# EAGLE design 512_outin_raspberry_pi (EAGLE 9.2.2)
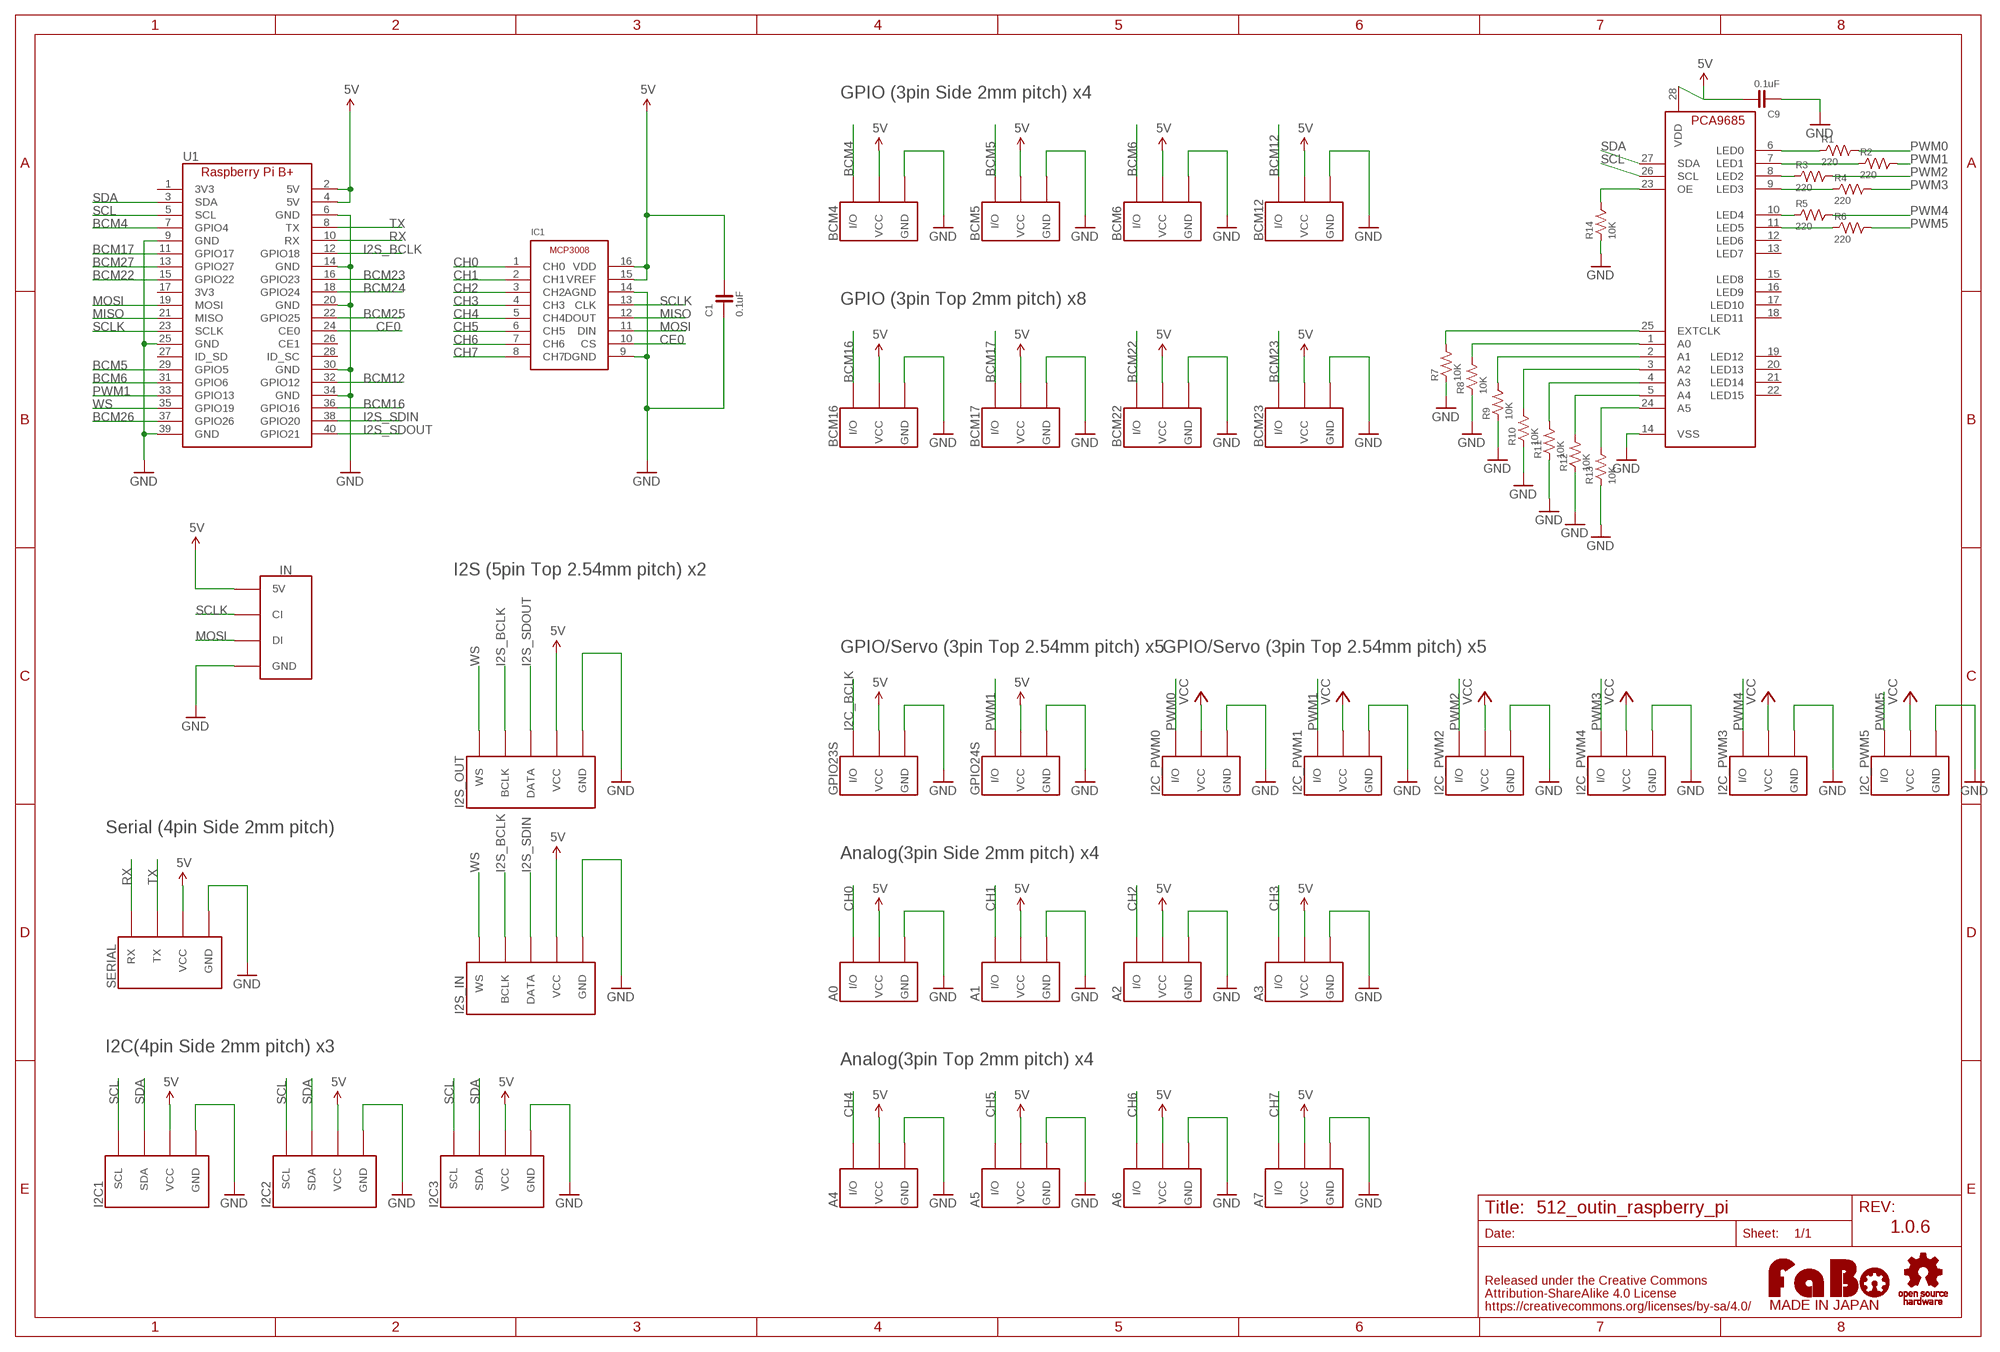
[diagram p0: schematic, sheet 1]

## Parts
A0  FABO_BRICK_3PIN-S03B-PASK-2  [FABO_BRICK_3PIN_S03B-PASK-2]
A1  FABO_BRICK_3PIN-S03B-PASK-2  [FABO_BRICK_3PIN_S03B-PASK-2]
A2  FABO_BRICK_3PIN-S03B-PASK-2  [FABO_BRICK_3PIN_S03B-PASK-2]
A3  FABO_BRICK_3PIN-S03B-PASK-2  [FABO_BRICK_3PIN_S03B-PASK-2]
A4  FABO_BRICK_3PIN-B03B-PASK-1  [FABO_BRICK_3PIN_B03B-PASK-1]
A5  FABO_BRICK_3PIN-B03B-PASK-1  [FABO_BRICK_3PIN_B03B-PASK-1]
A6  FABO_BRICK_3PIN-B03B-PASK-1  [FABO_BRICK_3PIN_B03B-PASK-1]
A7  FABO_BRICK_3PIN-B03B-PASK-1  [FABO_BRICK_3PIN_B03B-PASK-1]
BCM4  FABO_BRICK_3PIN-S03B-PASK-2  [FABO_BRICK_3PIN_S03B-PASK-2]
BCM5  FABO_BRICK_3PIN-S03B-PASK-2  [FABO_BRICK_3PIN_S03B-PASK-2]
BCM6  FABO_BRICK_3PIN-S03B-PASK-2  [FABO_BRICK_3PIN_S03B-PASK-2]
BCM12  FABO_BRICK_3PIN-S03B-PASK-2  [FABO_BRICK_3PIN_S03B-PASK-2]
BCM16  FABO_BRICK_3PIN-B03B-PASK-1  [FABO_BRICK_3PIN_B03B-PASK-1]
BCM17  FABO_BRICK_3PIN-B03B-PASK-1  [FABO_BRICK_3PIN_B03B-PASK-1]
BCM22  FABO_BRICK_3PIN-B03B-PASK-1  [FABO_BRICK_3PIN_B03B-PASK-1]
BCM23  FABO_BRICK_3PIN-B03B-PASK-1  [FABO_BRICK_3PIN_B03B-PASK-1]
C1  0.1uF  CAPACITOR-0603  [0603]
C9  0.1uF  CAPACITOR-0603  [0603]
GPIO23S  FABO_BRICK_3PIN-HEADER  [FABO_BRICK_3PIN_HEADER]
GPIO24S  FABO_BRICK_3PIN-HEADER  [FABO_BRICK_3PIN_HEADER]
I2C1  FABO_BRICK_I2C-S04B-PASK-2  [FABO_BRICK_I2C_S04B-PASK-2]
I2C2  FABO_BRICK_I2C-S04B-PASK-2  [FABO_BRICK_I2C_S04B-PASK-2]
I2C3  FABO_BRICK_I2C-S04B-PASK-2  [FABO_BRICK_I2C_S04B-PASK-2]
I2C_PWM0  FABO_BRICK_3PIN-HEADER  [FABO_BRICK_3PIN_HEADER]
I2C_PWM1  FABO_BRICK_3PIN-HEADER  [FABO_BRICK_3PIN_HEADER]
I2C_PWM2  FABO_BRICK_3PIN-HEADER  [FABO_BRICK_3PIN_HEADER]
I2C_PWM3  FABO_BRICK_3PIN-HEADER  [FABO_BRICK_3PIN_HEADER]
I2C_PWM4  FABO_BRICK_3PIN-HEADER  [FABO_BRICK_3PIN_HEADER]
I2C_PWM5  FABO_BRICK_3PIN-HEADER  [FABO_BRICK_3PIN_HEADER]
I2S_IN  FABO_BRICK_I2STOP  [FABO_BRICK_I2S_B05B-PARK-1]
I2S_OUT  FABO_BRICK_I2STOP  [FABO_BRICK_I2S_B05B-PARK-1]
IC1  MICROCHIP-MCP3008  [MICROCHIP-MCP3008]
LED  FABO_BRICK_SPI_LED  [FABO_BRICK_SPI_LED]
R1  220  RESISTOR-0603  [0603]
R2  220  RESISTOR-0603  [0603]
R3  220  RESISTOR-0603  [0603]
R4  220  RESISTOR-0603  [0603]
R5  220  RESISTOR-0603  [0603]
R6  220  RESISTOR-0603  [0603]
R7  10K  RESISTOR-0603  [0603]
R8  10K  RESISTOR-0603  [0603]
R9  10K  RESISTOR-0603  [0603]
R10  10K  RESISTOR-0603  [0603]
R11  10K  RESISTOR-0603  [0603]
R12  10K  RESISTOR-0603  [0603]
R13  10K  RESISTOR-0603  [0603]
R14  10K  RESISTOR-0603  [0603]
SERIAL  FABO_BRICK_SERIAL-S04B-PASK-2  [FABO_BRICK_SERIAL_S04B-PASK-2]
U1  RASPBERRY_PI_B+NORMAL  [RASPBERRY_PI_B+]
U$4  LOGO_OSHW-T_M_BOTTOM  [LOGO_OSHW_T_MS_BOTTOM]
U$9  PCA9685  [PCA9685]
U$14  LOGO_FABO-M  [LOGO_FABO_MS]

## Nets
5V: A0.VCC A1.VCC A2.VCC A3.VCC A4.VCC A5.VCC A6.VCC A7.VCC BCM4.VCC BCM5.VCC BCM6.VCC BCM12.VCC BCM16.VCC BCM17.VCC BCM22.VCC BCM23.VCC C1.2 C9.2 GPIO23S.VCC GPIO24S.VCC I2C1.VCC I2C2.VCC I2C3.VCC I2S_IN.VCC I2S_OUT.VCC IC1.15(VREF) IC1.16(VDD) LED.5V SERIAL.VCC U1.2(5V) U1.4(5V) U$9.28(VDD)
BCM4: BCM4.I/O U1.7(GPIO4)
BCM5: BCM5.I/O U1.29(GPIO5)
BCM6: BCM6.I/O U1.31(GPIO6)
BCM12: BCM12.I/O U1.32(GPIO12)
BCM16: BCM16.I/O U1.36(GPIO16)
BCM17: BCM17.I/O U1.11(GPIO17)
BCM22: BCM22.I/O U1.15(GPIO22)
BCM23: BCM23.I/O U1.16(GPIO23)
BCM24: U1.18(GPIO24)
BCM25: U1.22(GPIO25)
BCM26: U1.37(GPIO26)
BCM27: U1.13(GPIO27)
CE0: IC1.10(CS) U1.24(CE0)
CH0: A0.I/O IC1.1(CH0)
CH1: A1.I/O IC1.2(CH1)
CH2: A2.I/O IC1.3(CH2)
CH3: A3.I/O IC1.4(CH3)
CH4: A4.I/O IC1.5(CH4)
CH5: A5.I/O IC1.6(CH5)
CH6: A6.I/O IC1.7(CH6)
CH7: A7.I/O IC1.8(CH7)
GND: A0.GND A1.GND A2.GND A3.GND A4.GND A5.GND A6.GND A7.GND BCM4.GND BCM5.GND BCM6.GND BCM12.GND BCM16.GND BCM17.GND BCM22.GND BCM23.GND C1.1 C9.1 GPIO23S.GND GPIO24S.GND I2C1.GND I2C2.GND I2C3.GND I2C_PWM0.GND I2C_PWM1.GND I2C_PWM2.GND I2C_PWM3.GND I2C_PWM4.GND I2C_PWM5.GND I2S_IN.GND I2S_OUT.GND IC1.9(DGND) IC1.14(AGND) LED.GND R7.1 R8.1 R9.1 R10.1 R11.1 R12.1 R13.1 R14.1 SERIAL.GND U1.6(GND) U1.9(GND) U1.14(GND) U1.20(GND) U1.25(GND) U1.30(GND) U1.34(GND) U1.39(GND) U$9.14(VSS)
I2C_BCLK: GPIO23S.I/O
I2S_BCLK: I2S_IN.BCLK I2S_OUT.BCLK U1.12(GPIO18)
I2S_SDIN: I2S_IN.DATA U1.38(GPIO20)
I2S_SDOUT: I2S_OUT.DATA U1.40(GPIO21)
LED0: R1.1 U$9.6(LED0)
LED1: R2.1 U$9.7(LED1)
LED2: R3.1 U$9.8(LED2)
LED3: R4.1 U$9.9(LED3)
LED4: R5.1 U$9.10(LED4)
LED5: R6.1 U$9.11(LED5)
MISO: IC1.12(DOUT) U1.21(MISO)
MOSI: IC1.11(DIN) LED.DI U1.19(MOSI)
N$7: R14.2 U$9.23(OE)
N$8: R7.2 U$9.25(EXTCLK)
N$9: R8.2 U$9.1(A0)
N$10: R9.2 U$9.2(A1)
N$11: R10.2 U$9.3(A2)
N$12: R11.2 U$9.4(A3)
N$13: R12.2 U$9.5(A4)
N$14: R13.2 U$9.24(A5)
PWM0: I2C_PWM0.I/O R1.2
PWM1: GPIO24S.I/O I2C_PWM1.I/O R2.2 U1.33(GPIO13)
PWM2: I2C_PWM2.I/O R3.2
PWM3: I2C_PWM4.I/O R4.2
PWM4: I2C_PWM3.I/O R5.2
PWM5: I2C_PWM5.I/O R6.2
RX: SERIAL.RX U1.10(RX)
SCL: I2C1.SCL I2C2.SCL I2C3.SCL U1.5(SCL) U$9.26(SCL)
SCLK: IC1.13(CLK) LED.CI U1.23(SCLK)
SDA: I2C1.SDA I2C2.SDA I2C3.SDA U1.3(SDA) U$9.27(SDA)
TX: SERIAL.TX U1.8(TX)
VCC: I2C_PWM0.VCC I2C_PWM1.VCC I2C_PWM2.VCC I2C_PWM3.VCC I2C_PWM4.VCC I2C_PWM5.VCC
WS: I2S_IN.WS I2S_OUT.WS U1.35(GPIO19)
Unconnected: U1.1(3V3) U1.17(3V3) U1.26(CE1) U1.27(ID_SD) U1.28(ID_SC) U$9.12(LED6) U$9.13(LED7) U$9.15(LED8) U$9.16(LED9) U$9.17(LED10) U$9.18(LED11) U$9.19(LED12) U$9.20(LED13) U$9.21(LED14) U$9.22(LED15)

## Notes on the sheet
- GPIO (3pin Side 2mm pitch) x4
- GPIO (3pin Top 2mm pitch) x8
- I2S (5pin Top 2.54mm pitch) x2
- GPIO/Servo (3pin Top 2.54mm pitch) x5 | GPIO/Servo (3pin Top 2.54mm pitch) x5
- Serial (4pin Side 2mm pitch)
- Analog(3pin Side 2mm pitch) x4
- I2C(4pin Side 2mm pitch) x3
- Analog(3pin Top 2mm pitch) x4
- 1.0.6

## Library data of the parts
A0 A1-A7 BCM4-BCM6 BCM12 BCM16 BCM17 BCM22 BCM23 GPIO23S GPIO24S I2C_PWM0 I2C_PWM1-I2C_PWM5 = FaBo-Template:FABO_BRICK_3PIN: FaBo Brick 3pin
C1 C9 = FaBo-Capacitor:CAPACITOR: CAPACITOR
I2C1-I2C3 = FaBo-Template:FABO_BRICK_I2C: FaBo Brick I2C
I2S_IN I2S_OUT = FaBo-Template:FABO_BRICK_I2S
IC1 = FaBo-ADC:MICROCHIP-MCP3008
LED = FaBo-Template:FABO_BRICK_SPI_LED
R1-R14 = FaBo-Resistors:RESISTOR: RESISTOR
SERIAL = FaBo-Template:FABO_BRICK_SERIAL: FaBo Brick Serial
U1 = FaBo-Boards:RASPBERRY_PI_B+
U$4 = FaBo-etc:LOGO_OSHW
U$9 = FaBo-Motor:PCA9685
U$14 = FaBo-etc:LOGO_FABO

## Board
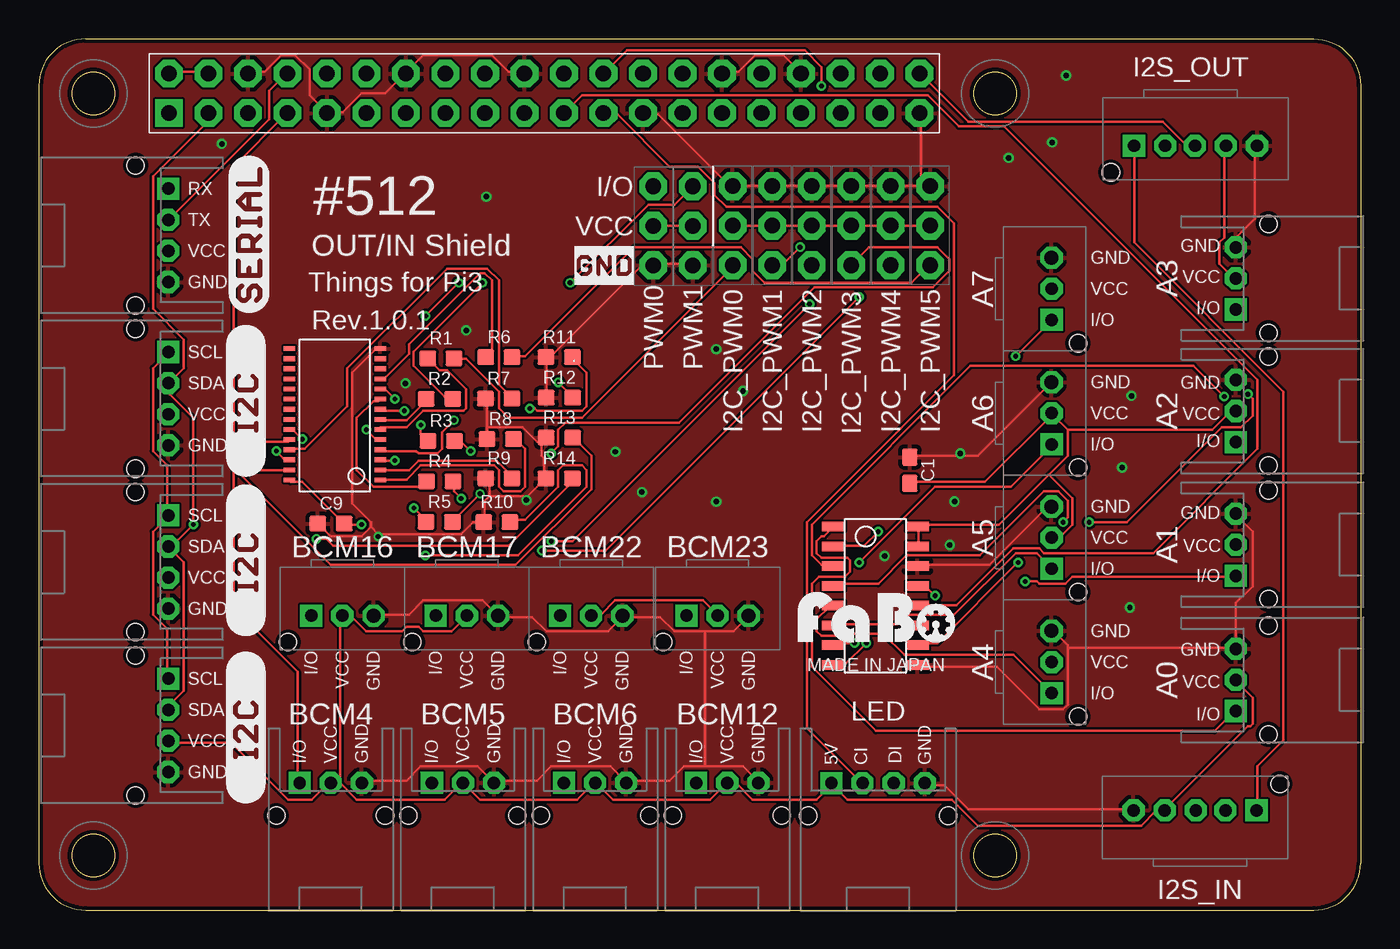
[diagram p1: board, top side]
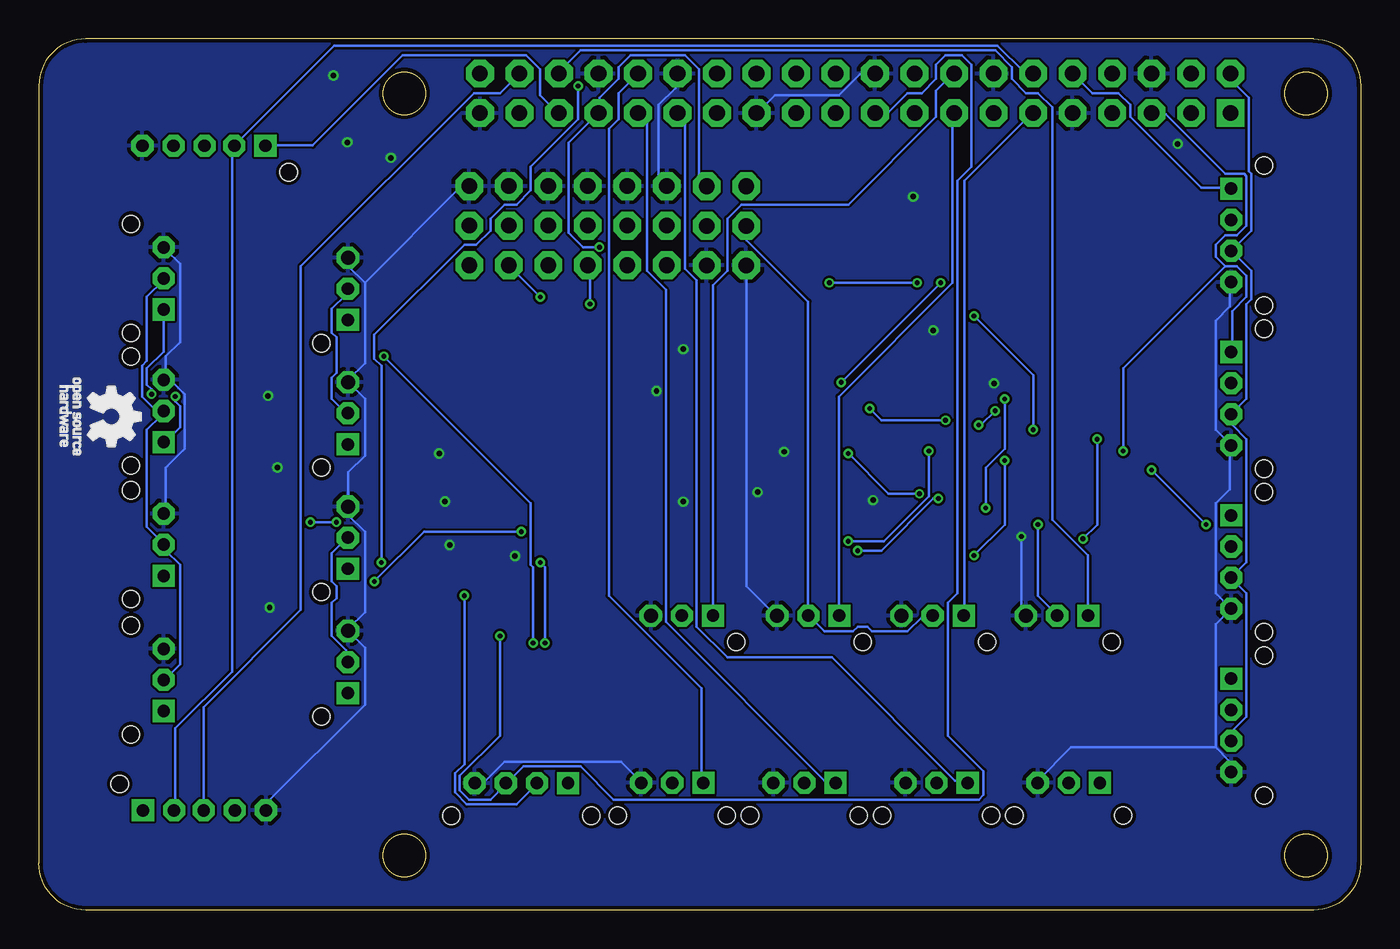
[diagram p2: board, bottom side, seen from below]

Size 85 x 56 mm. Coordinates in mm from the lower left corner, seen from the top.
Copper layers (1*16): Top 0.035mm / dielectric 1.5mm / Bottom 0.035mm
Design rules "Elecrow_2-layer_eagle_rule": minimum track width 6mil, minimum drill 12mil, track to track 6mil, track to pad 6mil, pad to pad 6mil, via to via 6mil, smd to smd 0mil, copper to edge 10mil, drill to drill 10mil, minimum pad ring 10mil, minimum via ring 6mil, stop-mask expansion 2mil, vias tented up to drill 100mil, thermal gap 10mil

### Footprints (pad centres in the part's own frame; a part is rotated, then mirrored left to right if it is on the bottom)
FABO_BRICK_3PIN_S03B-PASK-2 = drill 0.8 pad 1.422 octagon: GND -2,0; VCC 0,0 | drill 0.8 pad 1.422 square: I/O 2,0 | hole 1.1: 3.5,2.1; -3.5,2.1
FABO_BRICK_3PIN_B03B-PASK-1 = drill 0.9 pad 1.422 octagon: GND -2,0 | drill 0.8 pad 1.422 square: I/O 2,0 | drill 0.8 pad 1.422 octagon: VCC 0,0 | hole 1.1: 3.5,1.7
0603 = smd 1.1 x 1: 1 -0.85,0; 2 0.85,0
FABO_BRICK_3PIN_HEADER = drill 1 pad 1.778 octagon: GND -2.54,0; I/O 2.54,0; VCC 0,0
FABO_BRICK_I2C_S04B-PASK-2 = drill 0.8 pad 1.422 octagon: GND -3,0; SDA 1,0; VCC -1,0 | drill 0.8 pad 1.422 square: SCL 3,0 | hole 1.1: 4.5,2.1; -4.5,2.1
FABO_BRICK_I2S_B05B-PARK-1 = drill 0.8 pad 1.422 octagon: BCLK 1.635,2.54; DATA -0.27,2.54; GND -4.27,2.54; VCC -2.27,2.54 | drill 0.8 pad 1.422 square: WS 3.635,2.54 | hole 1.1: 5.135,4.24
MICROCHIP-MCP3008 = smd 0.6 x 1.5: 1 -4.445,-2.7; 2 -3.175,-2.7; 3 -1.905,-2.7; 4 -0.635,-2.7; 5 0.635,-2.7; 6 1.905,-2.7; 7 3.175,-2.7; 8 4.445,-2.7; 9 4.445,2.7; 10 3.175,2.7; 11 1.905,2.7; 12 0.635,2.7; 13 -0.635,2.7; 14 -1.905,2.7; 15 -3.175,2.7; 16 -4.445,2.7
FABO_BRICK_SPI_LED = drill 0.8 pad 1.422 square: 5V 3,-3.19 | drill 0.8 pad 1.422 octagon: CI 1,-3.19; DI -1,-3.19; GND -3,-3.19 | hole 1.1: 4.5,-1.09; -4.5,-1.09
FABO_BRICK_SERIAL_S04B-PASK-2 = drill 0.8 pad 1.422 octagon: GND -3,0; TX 1,0; VCC -1,0 | drill 0.8 pad 1.422 square: RX 3,0 | hole 1.1: 4.5,2.1; -4.5,2.1
RASPBERRY_PI_B+ = drill 1 pad 1.778 square: 1 0,-2.54 | drill 1 pad 1.778 octagon: 2 0,0; 3 2.54,-2.54; 4 2.54,0; 5 5.08,-2.54; 6 5.08,0; 7 7.62,-2.54; 8 7.62,0; 9 10.16,-2.54; 10 10.16,0; 11 12.7,-2.54; 12 12.7,0; 13 15.24,-2.54; 14 15.24,0; 15 17.78,-2.54; 16 17.78,0; 17 20.32,-2.54; 18 20.32,0; 19 22.86,-2.54; 20 22.86,0; 21 25.4,-2.54; 22 25.4,0; 23 27.94,-2.54; 24 27.94,0; 25 30.48,-2.54; 26 30.48,0; 27 33.02,-2.54; 28 33.02,0; 29 35.56,-2.54; 30 35.56,0; 31 38.1,-2.54; 32 38.1,0; 33 40.64,-2.54; 34 40.64,0; 35 43.18,-2.54; 36 43.18,0; 37 45.72,-2.54; 38 45.72,0; 39 48.26,-2.54; 40 48.26,0
PCA9685 = smd 0.3 x 0.75: 1 -4.15,-2.93; 2 -3.5,-2.93; 3 -2.85,-2.93; 4 -2.2,-2.93; 5 -1.55,-2.93; 6 -0.9,-2.93; 7 -0.25,-2.93; 8 0.4,-2.93; 9 1.05,-2.93; 10 1.7,-2.93; 11 2.35,-2.93; 12 3,-2.93; 13 3.65,-2.93; 14 4.3,-2.93; 15 4.3,2.92; 16 3.65,2.92; 17 3,2.92; 18 2.35,2.92; 19 1.7,2.92; 20 1.05,2.92; 21 0.4,2.92; 22 -0.25,2.92; 23 -0.9,2.92; 24 -1.55,2.92; 25 -2.2,2.92; 26 -2.85,2.92; 27 -3.5,2.92; 28 -4.15,2.92

### Placement (x,y rotation side)
A0  76.97,14.79 270 top
A1  76.97,23.49 270 top
A2  76.97,32.08 270 top
A3  76.97,40.6 270 top
A4  65.12,15.94 270 top
A5  65.12,23.94 270 top
A6  65.12,31.94 270 top
A7  65.12,39.94 270 top
BCM4  18.77,8.17 180 top
BCM5  27.27,8.17 180 top
BCM6  35.77,8.17 180 top
BCM12  44.27,8.17 180 top
BCM16  19.52,18.92 180 top
BCM17  27.52,18.92 180 top
BCM22  35.52,18.92 180 top
BCM23  43.65,18.93 180 top
C1  56.01,28.27 270 top
C9  18.79,24.84 0 top
GPIO23S  39.52,43.99 90 top
GPIO24S  42.05,43.99 90 top
I2C1  8.32,32.87 90 top
I2C2  8.32,22.37 90 top
I2C3  8.32,11.87 90 top
I2C_PWM0  44.62,43.99 270 top
I2C_PWM1  47.16,43.99 270 top
I2C_PWM2  49.7,43.99 270 top
I2C_PWM3  52.24,43.99 270 top
I2C_PWM4  54.78,43.99 270 top
I2C_PWM5  57.32,43.99 270 top
I2S_IN  74.67,3.87 0 top
I2S_OUT  74.07,51.67 180 top
IC1  53.8,20.2 270 top
LED  53.97,4.97 180 top
R1  25.85,35.46 0 top
R2  25.76,32.86 0 top
R3  25.87,30.16 0 top
R4  25.78,27.56 0 top
R5  25.75,24.95 0 top
R6  29.58,35.54 0 top
R7  29.57,32.87 0 top
R8  29.67,30.27 0 top
R9  29.58,27.75 0 top
R10  29.45,24.94 0 top
R11  33.46,35.54 0 top
R12  33.47,32.94 0 top
R13  33.47,30.37 0 top
R14  33.46,27.75 0 top
SERIAL  8.32,43.37 90 top
U1  8.37,53.77 0 top
U$2  [LOGO_SILK_I2C]  14.57,17.62 90 top
U$3  [LOGO_SILK_SERIAL2]  14.82,38.37 90 top
U$4  80.37,31.71 90 top
U$5  [LOGO_SILK_I2C]  14.57,6.87 90 top
U$6  [LOGO_SILK_I2C]  14.57,27.87 90 top
U$7  [LOGO_SILK_GND]  34.44,40.18 0 top
U$9  19.03,31.79 90 top
U$14  53.88,16.82 0 top

### Tracks (layer width: path | path; a pad name or v marks a point on that pad's centre or on a via)
5V  (via drill 0.3)
  Top 0.152: IC1.15 56.57,23.41 56.57,24.63 IC1.16 56.57,24.78 61.75,24.78 64.95,27.98 | C1.2 56.11,27.52 60.84,27.52 65.1,31.79 A6.VCC 65.25,31.79 66.17,30.87 | 64.95,27.98 66.17,29.2 66.17,30.87 | 64.95,27.98 66.47,26.45 66.47,24.78 65.71,24.02 65.25,24.02 A5.VCC | I2S_OUT.VCC 76.23,49.01 76.23,43.22 75.92,42.91 75.92,41.54 76.84,40.63 A3.VCC | A0.VCC 76.99,14.72 78.06,13.65 78.06,11.98 77.9,11.82 77.75,11.82 72.42,6.49 I2S_IN.VCC 72.26,6.34 71.81,6.34 70.89,5.42 60.38,5.42 58.7,7.1 52,7.1 51.08,8.01 LED.5V 50.93,8.01 50.01,7.1 45.9,7.1 44.83,8.17 44.38,8.17 BCM12.VCC 44.22,8.17 43.16,7.1 36.91,7.1 35.84,8.17 BCM6.VCC 35.69,8.17 34.62,7.1 28.37,7.1 27.31,8.17 BCM5.VCC 27.15,8.17 26.09,7.1 20.45,7.1 19.38,8.17 | 66.17,30.87 75.46,30.87 76.53,31.94 76.84,31.94 A2.VCC | U1.2 8.41,53.89 10.85,53.89 U1.4 | 19.38,8.17 BCM4.VCC | U$9.28 16.18,27.52 16.94,27.52 19.53,24.93 C9.2 19.69,24.78 v20.75,24.78 | BCM17.VCC 27.46,18.83 26.55,17.92 24.72,17.92 24.41,18.23 23.65,18.23 23.34,17.92 21.06,17.92 20.14,18.83 19.53,18.83 BCM16.VCC 19.38,18.83 19.38,8.17 | GPIO23S.VCC 39.65,43.98 41.94,43.98 GPIO24S.VCC | BCM22.VCC 35.54,18.99 36.15,18.99 37.06,19.9 42.7,19.9 43.61,18.99 BCM23.VCC | 19.38,8.17 BCM4.VCC | I2C3.VCC 8.41,10.76 12.37,10.76 16.03,7.1 17.55,7.1 18.62,8.17 BCM4.VCC
  Bottom 0.152: A4.VCC 65.25,15.94 65.25,16.7 66.17,17.62 66.17,19.75 65.86,20.05 65.86,20.82 66.17,21.12 66.17,22.95 65.25,23.86 A5.VCC | A7.VCC 65.25,39.87 65.25,39.56 66.17,38.65 66.17,37.12 65.86,36.82 65.86,34.53 66.17,34.23 66.17,32.86 65.25,31.94 A6.VCC | A0.VCC 76.84,14.87 75.92,15.79 75.92,22.19 76.84,23.1 76.84,23.41 A1.VCC 76.99,23.56 78.06,24.63 78.06,30.87 77.14,31.79 | 77.14,31.79 76.99,31.94 A2.VCC 77.14,31.79 | 77.14,31.79 78.36,33.01 78.36,34.99 78.06,35.29 78.06,39.41 76.99,40.48 A3.VCC | I2C3.VCC 8.26,10.91 8.26,11.52 7.34,12.43 7.34,20.36 8.26,21.27 I2C2.VCC 8.26,21.43 7.34,22.34 7.34,30.26 8.26,31.18 8.26,31.79 I2C1.VCC 8.26,31.94 7.34,32.86 7.34,38.95 7.04,39.26 7.04,41.09 8.26,42.3 SERIAL.VCC 8.26,42.46 7.04,43.68 7.04,47.33 7.19,47.49 7.19,52.21 8.26,53.28 8.26,53.73 U1.2 | v20.75,24.78 20.75,20.21 19.53,18.99 BCM16.VCC | GPIO23S.VCC 39.5,43.98 39.5,43.07 35.54,39.1 35.54,18.99 BCM22.VCC 35.38,18.83 34.47,17.92 32.64,17.92 32.34,18.23 31.73,18.23 31.42,17.92 29.14,17.92 28.22,18.83 27.61,18.83 BCM17.VCC
BCM4
  Top 0.152: BCM4.I/O 16.64,8.32 16.64,15.33 12.52,19.44 12.52,47.79 15.88,51.14 U1.7
BCM5
  Bottom 0.152: BCM5.I/O 25.33,8.32 26.09,8.32 34.01,16.24 40.72,16.24 42.7,18.23 42.7,40.48 43.46,41.24 43.46,50.69 43.92,51.14 U1.29
BCM6
  Bottom 0.152: BCM6.I/O 33.86,8.32 34.47,8.32 44.68,18.53 44.68,39.87 45.9,41.09 45.9,50.69 46.36,51.14 U1.31
BCM12
  Bottom 0.152: BCM12.I/O 42.39,8.32 42.39,14.26 48.34,20.21 48.34,50.23 47.73,50.84 47.73,52.52 46.51,53.73 U1.32
BCM16
  Bottom 0.152: BCM16.I/O 17.55,18.99 17.55,22.8 19.84,25.08 19.84,51.6 20.75,52.52 21.52,52.52 22.43,53.43 22.43,54.19 23.5,55.26 50.17,55.26 51.54,53.89 U1.36
BCM17
  Bottom 0.152: BCM17.I/O 25.48,18.99 25.48,46.88 21.21,51.14 U1.11
BCM22
  Bottom 0.152: BCM22.I/O 33.55,18.99 33.55,33.01 26.24,40.32 26.24,51.14 U1.15
BCM23
  Bottom 0.152: BCM23.I/O 41.63,18.99 41.63,40.17 40.72,41.09 40.72,44.44 39.8,45.35 32.95,45.35 27.31,50.99 27.31,52.67 26.24,53.73 U1.16
CE0  (via drill 0.3)
  Top 0.152: v62.97,22.34 57.79,17.16 56.57,17.16 IC1.10 | v50.32,52.97 50.32,54.19 49.25,55.26 37.82,55.26 36.45,53.89 U1.24
  Bottom 0.152: v62.97,22.34 62.97,34.99 63.43,35.45 63.43,36.97 57.63,42.76 56.87,42.76 55.96,43.68 55.96,44.44 55.04,45.35 54.28,45.35 53.37,46.27 53.37,47.79 50.32,50.84 v50.32,52.97
CH0
  Top 0.152: IC1.1 51.08,24.63 50.47,24.02 50.32,24.02 50.01,23.71 50.01,22.95 50.32,22.64 52,22.64 52.15,22.49 52.15,21.73 51.84,21.43 50.17,21.43 49.71,20.97 49.71,15.63 53.82,11.52 75.62,11.52 76.84,12.74 A0.I/O
CH1  (via drill 0.3)
  Top 0.152: v53.98,24.32 53.06,23.41 51.23,23.41 IC1.2 | v63.43,21.12 64.19,21.12 64.34,20.97 66.02,20.97 66.47,21.43 76.84,21.43 A1.I/O
  Bottom 0.152: v53.98,24.32 60.23,24.32 v63.43,21.12
CH2  (via drill 0.3)
  Top 0.152: v76.23,33.01 74.25,34.99 59.92,34.99 49.71,24.78 49.71,22.8 50.32,22.19 51.08,22.19 IC1.3
  Bottom 0.152: v76.23,33.01 76.23,32.7 75.92,32.4 75.92,31.03 76.84,30.11 A2.I/O
CH3  (via drill 0.3)
  Top 0.152: v65.86,24.93 66.17,25.24 66.17,26.3 65.56,26.91 64.64,26.91 60.53,22.8 55.81,22.8 53.98,20.97 51.23,20.97 IC1.4 | v67.54,24.93 69.98,24.93 76.07,31.03 77.29,31.03 78.06,31.79 78.06,32.86 v77.75,33.16
  Bottom 0.152: v67.54,24.93 v65.86,24.93 | v77.75,33.16 77.75,33.47 78.06,33.77 78.06,34.84 76.99,35.9 76.99,38.49 A3.I/O
CH4
  Top 0.152: IC1.5 51.08,19.44 50.78,19.44 50.01,18.68 50.01,17.92 50.32,17.62 52.15,17.62 52.3,17.77 54.28,17.77 55.65,16.4 62.66,16.4 65.1,13.96 A4.I/O
CH5
  Top 0.152: IC1.6 51.23,18.38 55.2,18.38 55.81,18.99 58.85,18.99 62.82,22.95 64.19,22.95 65.1,22.04 A5.I/O
CH6  (via drill 0.3)
  Top 0.152: v52.45,17.16 51.23,17.16 IC1.7 | v52.76,22.34 57.63,27.22 62.51,27.22 65.1,29.81 A6.I/O
  Bottom 0.152: v52.45,17.16 52.45,22.04 v52.76,22.34
CH7  (via drill 0.3)
  Top 0.152: v53.22,17.16 51.84,15.79 51.23,15.79 IC1.8 | v62.82,35.6 65.1,37.88 A7.I/O
  Bottom 0.152: v53.22,17.16 53.22,22.04 53.37,22.19 53.37,26.15 v62.82,35.6
GND  (via drill 0.3, 0.35)
  Top 0.152: 28.98,26.61 28.68,26.3 28.68,25.08 R10.1 28.53,24.93 27.92,24.93 27.15,24.17 21.82,24.17 | 28.98,26.61 28.98,27.52 28.83,27.67 R9.1 | 32.34,30.11 32.34,29.2 32.49,29.05 32.49,27.83 R14.1 32.49,27.67 31.42,26.61 28.98,26.61 | 32.34,30.11 32.49,30.26 R13.1 32.34,30.11 | 28.83,31.03 28.83,32.86 R7.1 | 28.83,31.03 28.83,30.42 R8.1 | 32.34,30.11 32.03,30.11 31.12,31.03 28.83,31.03 | 21.36,24.63 21.36,24.93 20.14,26.15 20.14,34.53 21.67,36.06 21.82,36.06 U$9.14 | 21.36,24.63 20.75,24.02 18.77,24.02 18.01,24.78 C9.1 | 21.36,24.63 21.82,24.17 | R12.1 32.64,33.01 32.64,35.45 R11.1 32.64,35.6 32.95,35.6 38.74,41.39 39.5,41.39 GPIO23S.GND 39.65,41.54 41.94,41.54 GPIO24S.GND | BCM16.GND 21.67,18.99 23.8,18.99 24.72,19.9 28.53,19.9 29.44,18.99 BCM17.GND 29.59,18.83 31.73,18.83 32.64,17.92 36.6,17.92 37.52,18.83 BCM22.GND 37.67,18.83 39.96,18.83 40.87,17.92 42.85,17.92 | 42.85,17.92 44.68,17.92 45.59,18.83 BCM23.GND | v21.82,24.02 21.82,24.17 | BCM4.GND 20.91,8.32 23.65,8.32 24.56,9.23 28.22,9.23 29.14,8.32 BCM5.GND 29.29,8.32 32.03,8.32 32.95,9.23 36.76,9.23 37.67,8.32 BCM6.GND 37.82,8.32 40.57,8.32 41.48,9.23 42.85,9.23 | 42.85,9.23 45.29,9.23 46.2,8.32 BCM12.GND | I2S_IN.GND 70.28,6.49 59.77,6.49 58.24,8.01 57.02,8.01 LED.GND | 42.85,9.23 42.85,17.92 | U1.6 13.59,53.89 14.5,53.89 15.57,54.95 16.49,54.95 17.4,54.04 17.4,52.36 18.47,51.3 U1.9 18.62,51.3 19.53,51.3 20.75,52.52 22.28,52.52 23.5,53.73 U1.14 23.65,53.89 24.72,54.95 29.14,54.95 30.2,53.89 31.12,53.89 U1.20 | 56.72,46.57 54.89,46.57 I2C_PWM4.GND 54.74,46.57 52.3,46.57 I2C_PWM3.GND 52.15,46.57 49.71,46.57 I2C_PWM2.GND 49.56,46.57 47.27,46.57 I2C_PWM1.GND 47.12,46.57 44.68,46.57 I2C_PWM0.GND 44.53,46.42 39.8,51.14 38.89,51.14 U1.25
  Top 0.152: 56.72,46.57 57.18,46.57 I2C_PWM5.GND 56.72,46.57 | 56.72,46.57 56.72,51.14 U1.39 | U1.30 44.07,53.89 44.98,53.89 46.05,54.95 47.88,54.95 48.95,53.89 U1.34 | A1.GND 76.99,25.39 78.06,24.32 78.06,20.82 76.99,19.75 76.99,16.85 A0.GND 76.84,16.85 66.17,16.85 | I2S_OUT.GND 78.21,49.01 78.21,44.44 76.99,43.22 76.99,42.61 A3.GND | IC1.14 56.57,22.19 61.14,22.19 64.8,25.85 65.1,25.85 A5.GND | 66.17,16.85 66.17,17.01 65.25,17.92 A4.GND | 66.17,16.85 66.17,13.2 65.86,12.89 64.34,12.89 61.6,15.63 56.57,15.63 IC1.9 | C1.1 56.11,29.2 60.38,29.2 65.1,33.92 A6.GND
  Bottom 0.152: GPIO23S.GND 39.5,41.39 39.5,20.82 37.67,18.99 BCM22.GND | v21.82,24.02 21.82,19.14 21.67,18.99 BCM16.GND | 9.32,10.45 8.41,9.54 8.41,8.93 I2C3.GND | 9.32,10.45 9.32,18.38 8.41,19.29 I2C2.GND 8.41,19.44 9.32,20.36 9.32,26.15 8.41,27.06 8.41,29.81 I2C1.GND 8.41,29.96 9.32,30.87 9.32,37.88 8.41,38.8 8.41,40.32 SERIAL.GND | LED.GND 56.87,8.17 56.41,8.17 55.04,9.54 47.58,9.54 46.36,8.32 BCM12.GND | 9.32,10.45 18.62,10.45 20.75,8.32 BCM4.GND | U1.30 44.07,53.73 44.07,52.82 45.14,51.75 45.14,47.03 44.68,46.57 I2C_PWM0.GND | U1.20 31.27,53.73 32.18,53.73 33.55,52.36 37.67,52.36 38.74,51.3 U1.25 | 76.84,34.38 76.84,35.6 75.92,36.51 75.92,41.54 76.84,42.46 A3.GND | 76.84,34.38 76.84,34.23 A2.GND 76.84,34.38 | 76.84,34.38 75.62,33.16 75.62,29.66 76.84,28.44 76.84,25.54 A1.GND | 64.03,40.32 65.1,41.39 65.1,41.85 A7.GND | 64.03,40.32 64.03,35.14 65.1,34.07 A6.GND 65.1,33.92 64.03,32.86 64.03,29.2 65.1,28.13 65.1,26 A5.GND 65.1,25.85 65.1,25.39 64.03,24.32 64.03,19.14 65.1,18.07 A4.GND 65.1,17.92 64.03,16.85 64.03,13.2 70.28,6.95 70.28,6.49 I2S_IN.GND | 64.03,40.32 57.94,46.42 57.33,46.42 I2C_PWM5.GND
  other vias: 28.78,45.86 59.26,29.35 70.26,33.05 69.66,28.45 43.56,26.25 70.16,19.45 65.16,49.35 66.06,53.65 62.36,48.35 11.76,49.25 31.36,26.35 43.56,36.05 37.08,29.46 27.48,37.26 23.58,33.86 58.88,26.26 54.38,22.76 58.58,23.46 45.28,33.36 38.78,26.86
  pour Top: -0.43,-1.13 85.93,-1.13 85.93,0.14 85.93,56.02 84.66,56.02 -0.43,56.02
  pour Bottom: -0.43,-1.13 85.93,-1.13 85.93,0.14 85.93,56.02 -0.43,56.02
I2S_BCLK
  Bottom 0.152: I2S_IN.BCLK 76.23,6.49 76.23,11.67 72.57,15.33 72.57,49.01 I2S_OUT.BCLK 72.42,49.16 66.02,55.56 23.34,55.56 21.67,53.89 21.21,53.89 U1.12
I2S_SDIN
  Bottom 0.152: I2S_IN.DATA 74.4,6.49 74.4,13.04 68.15,19.29 68.15,41.39 57.02,52.52 55.35,52.52 54.13,53.73 U1.38
I2S_SDOUT
  Top 0.152: I2S_OUT.DATA 74.25,49.16 73.79,49.16 72.26,50.69 59.77,50.69 56.72,53.73 U1.40
LED0
  Top 0.152: U$9.6 21.97,31.03 23.65,31.03 24.72,32.09 27.31,32.09 27.46,32.25 27.46,33.47 26.24,34.68 25.78,34.68 25.02,35.45 R1.1
LED1
  Top 0.152: U$9.7 21.97,31.48 23.65,31.48 25.02,32.86 R2.1
LED2  (via drill 0.3)
  Top 0.152: v23.5,32.09 21.97,32.09 U$9.8 | v24.56,31.18 24.56,30.57 24.87,30.26 R3.1
  Bottom 0.152: v23.5,32.09 24.41,31.18 v24.56,31.18
LED3
  Top 0.152: U$9.9 21.82,32.7 21.52,32.7 20.45,31.64 20.45,28.28 21.52,27.22 24.56,27.22 24.87,27.52 R4.1
LED4  (via drill 0.3)
  Top 0.152: v22.89,32.86 22.28,33.47 21.97,33.47 U$9.10 | v24.11,25.85 24.87,25.08 R5.1
  Bottom 0.152: v22.89,32.86 22.89,29.66 24.11,28.44 v24.11,25.85
LED5
  Top 0.152: U$9.11 21.97,34.23 22.28,34.23 23.8,35.75 23.8,36.36 28.37,40.93 28.68,40.93 29.14,40.48 29.14,35.9 28.83,35.6 R6.1
MISO
  Top 0.152: IC1.12 56.57,19.6 59.01,19.6 62.66,23.25 64.34,23.25 64.64,22.95 71.65,22.95 78.36,29.66 78.36,34.07 62.05,50.38 59.16,50.38 57.18,52.36 34.93,52.36 33.86,51.3 U1.21
MOSI  (via drill 0.3)
  Top 0.152: v55.35,17.62 55.96,18.23 56.41,18.23 IC1.11
  Bottom 0.152: v55.35,17.62 55.35,11.21 57.94,8.62 57.94,7.71 57.33,7.1 55.96,7.1 55.04,8.01 LED.DI 54.89,8.17 53.82,9.23 50.17,9.23 48.03,7.1 24.56,7.1 24.26,7.4 24.26,8.93 26.55,11.21 26.55,19.75 25.93,20.36 25.93,46.88 25.02,47.79 25.02,54.34 25.63,54.95 26.7,54.95 27.31,54.34 27.31,53.43 28.22,52.52 29.14,52.52 30.35,51.3 31.12,51.3 U1.19
N$7  (via drill 0.3)
  Top 0.152: v16.94,30.26 16.33,30.87 16.18,30.87 U$9.23 | v17.86,23.86 18.47,23.86 18.92,23.41 30.2,23.41 34.16,27.37 34.16,27.67 R14.2
  Bottom 0.152: v16.94,30.26 16.94,24.78 v17.86,23.86
N$8
  Top 0.152: U$9.25 16.18,29.66 17.1,29.66 19.84,32.4 19.84,34.84 26.24,41.24 28.83,41.24 29.59,40.48 29.59,33.77 30.35,33.01 R7.2
N$9
  Top 0.152: U$9.1 21.97,27.67 23.65,27.67 24.56,28.59 29.29,28.59 29.59,28.28 29.59,27.22 29.9,26.91 30.96,26.91 31.27,27.22 31.27,29.66 30.66,30.26 R8.2
N$10
  Top 0.152: U$9.2 21.97,28.28 23.8,28.28 24.41,28.89 29.44,28.89 30.51,27.83 R9.2
N$11  (via drill 0.3)
  Top 0.152: v22.89,28.89 21.97,28.89 U$9.3 | v24.87,22.8 30.81,22.8 35.23,27.22 35.23,28.28 34.93,28.59 33.71,28.59 33.4,28.28 33.4,27.22 31.27,25.08 30.35,25.08 R10.2
  Bottom 0.152: v22.89,28.89 22.89,24.78 v24.87,22.8
N$12  (via drill 0.3)
  Top 0.152: v26.7,31.48 25.93,30.72 25.93,29.66 25.63,29.35 24.41,29.35 24.26,29.5 21.97,29.5 U$9.4 | v31.57,32.25 31.88,32.25 32.03,32.09 34.93,32.09 35.23,32.4 35.23,34.53 34.32,35.45 R11.2
  Bottom 0.152: v26.7,31.48 30.81,31.48 v31.57,32.25
N$13  (via drill 0.3)
  Top 0.152: v21.06,30.87 21.67,30.26 21.82,30.26 U$9.5 | v27,40.32 v24.87,38.19 | v33.4,33.92 34.32,33.01 R12.2
  Bottom 0.152: v21.06,30.87 21.06,34.38 v24.87,38.19 | v33.4,33.92 v27,40.32
N$14
  Top 0.152: U$9.24 16.03,30.11 14.5,30.11 12.83,28.44 12.83,28.13 18.77,22.19 30.66,22.19 35.54,27.06 35.54,29.2 34.47,30.26 R13.2
PWM0
  Top 0.152: R1.2 26.85,35.45 27.46,35.45 29.59,33.31 29.59,32.25 30.2,31.64 34.93,31.64 44.68,41.39 I2C_PWM0.I/O
PWM1  (via drill 0.3)
  Top 0.152: v48.95,42.61 47.88,41.54 47.27,41.54 I2C_PWM1.I/O | v28.53,40.32 24.11,35.9 24.11,34.99 26.09,33.01 26.55,33.01 R2.2 | v34.16,40.32 39.19,45.35 40.87,45.35 41.94,46.42 GPIO24S.I/O
  Bottom 0.152: v48.95,42.61 50.01,42.61 50.93,43.52 50.93,49.31 49.1,51.14 U1.33 48.95,51.3 48.95,52.21 47.73,53.43 47.73,54.19 46.97,54.95 43.46,54.95 42.55,54.04 42.55,47.03 42.09,46.57 GPIO24S.I/O | v34.16,40.32 v28.53,40.32
PWM2  (via drill 0.3)
  Top 0.152: v27.76,29.5 27.15,30.11 26.85,30.11 R3.2 | v32.95,23.71 34.32,23.71 v49.56,38.95
  Bottom 0.152: v27.76,29.5 27.76,26.61 30.66,23.71 v32.95,23.71 | v49.56,38.95 49.56,41.39 I2C_PWM2.I/O
PWM3  (via drill 0.3)
  Top 0.152: v27.15,26.45 26.7,26.91 26.7,27.52 R4.2 | v32.34,23.1 36.45,23.1 v52.76,39.41
  Bottom 0.152: v27.15,26.45 27.46,26.45 30.81,23.1 v32.34,23.1 | v52.76,39.41 54.74,41.39 I2C_PWM4.I/O
PWM4  (via drill 0.3)
  Top 0.152: v28.37,26.76 26.7,25.08 R5.2 | v32.95,29.35 33.4,29.81 33.4,30.87 33.86,31.33 41.17,31.33 49.86,40.02 57.48,40.02 58.55,41.09 58.55,41.85 57.79,42.61 53.37,42.61 52.3,41.54 I2C_PWM3.I/O
  Bottom 0.152: v28.37,26.76 30.35,26.76 v32.95,29.35
PWM5
  Top 0.152: R6.2 30.51,35.6 31.27,35.6 38.28,42.61 45.14,42.61 45.9,41.85 45.9,41.09 46.66,40.32 56.11,40.32 57.18,41.39 I2C_PWM5.I/O
RX
  Bottom 0.152: SERIAL.RX 8.41,46.42 10.24,46.42 14.81,50.99 14.81,51.75 15.57,52.52 17.25,52.52 18.47,53.73 U1.10
SCL  (via drill 0.3)
  Top 0.152: I2C3.SCL 8.26,14.87 8.26,18.07 7.34,18.99 7.34,24.32 8.26,25.24 I2C2.SCL 8.26,25.39 8.26,28.59 7.34,29.5 7.34,34.84 8.26,35.75 I2C1.SCL | v15.27,29.5 15.72,29.05 16.03,29.05 U$9.26
  Bottom 0.152: v15.27,29.5 15.27,34.84 8.71,41.39 | 8.71,41.39 7.95,41.39 7.34,40.78 7.34,39.41 8.26,38.49 8.26,35.9 I2C1.SCL | 8.71,41.39 9.32,42 9.32,42.76 8.71,43.37 7.95,43.37 7.34,43.98 7.34,47.18 7.49,47.33 8.71,47.33 12.52,51.14 13.44,51.14 U1.5
SCLK  (via drill 0.3)
  Top 0.152: v57.63,20.21 57.02,20.82 56.57,20.82 IC1.13 | U1.23 36.45,51.14 37.21,51.14 40.57,47.79 42.39,47.79 43.46,46.72 43.46,45.96 44.22,45.2 57.79,45.2 58.85,44.13 58.85,34.38 49.41,24.93 49.41,11.67 52.91,8.17 LED.CI
  Bottom 0.152: v57.63,20.21 57.63,9.39 58.24,8.78 58.24,7.56 57.48,6.8 54.28,6.8 53.06,8.01 LED.CI
SDA  (via drill 0.3)
  Top 0.152: v13.44,28.28 16.03,28.28 U$9.27 | 8.41,23.25 v9.93,24.78 9.93,31.64 8.41,33.16 8.41,33.77 I2C1.SDA 8.41,33.92 9.32,34.84 9.32,36.67 7.34,38.65 7.34,47.18 10.85,50.69 10.85,51.14 U1.3 | 8.41,23.25 9.32,22.34 9.32,14.11 8.41,13.2 8.41,12.89 I2C3.SDA | 8.41,23.25 I2C2.SDA
  Bottom 0.152: v9.93,24.78 v13.44,28.28
TX
  Top 0.152: SERIAL.TX 8.41,44.44 14.81,50.84 14.81,52.67 15.88,53.73 U1.8
VCC
  Top 0.152: I2C_PWM0.VCC 44.68,43.98 47.12,43.98 I2C_PWM1.VCC 47.27,43.98 49.56,43.98 I2C_PWM2.VCC 52.15,43.98 I2C_PWM3.VCC 52.3,43.98 54.74,43.98 I2C_PWM4.VCC 54.89,43.98 57.18,43.98 I2C_PWM5.VCC
WS
  Top 0.152: I2S_IN.WS 78.36,6.49 78.36,9.23 80.04,10.91 80.04,33.31 70.44,42.91 70.44,49.01 I2S_OUT.WS
  Bottom 0.152: I2S_OUT.WS 70.28,49.16 67.39,49.16 61.6,54.95 53.67,54.95 52.76,54.04 52.76,52.36 51.69,51.3 U1.35

### Text on the board
tPlace: RX | I/O | TX | #512 | VCC | VCC | GND | OUT/IN Shield | GND | GND | VCC | Things for Pi3 | PWM0 | PWM1 | VCC | I/O | I/O | Rev.1.0.1 | SCL | SDA | GND | GND | VCC | VCC | VCC | GND | I/O | I/O | GND | GND | SCL | VCC | VCC | SDA | I/O | I/O | VCC | GND | GND | I/O | VCC | GND | I/O | VCC | GND | I/O | VCC | GND | I/O | VCC | GND | GND | MADE IN JAPAN | VCC | SCL | VCC | I/O | SDA | I/O | VCC | I/O | VCC | GND | I/O | VCC | GND | I/O | VCC | GND | I/O | VCC | GND | DI | GND | 5V | CI | GND